# Altium schematic sheet Bowlong Machine.SchDoc
size A3; SheetNumber: 1; SheetTotal: 1
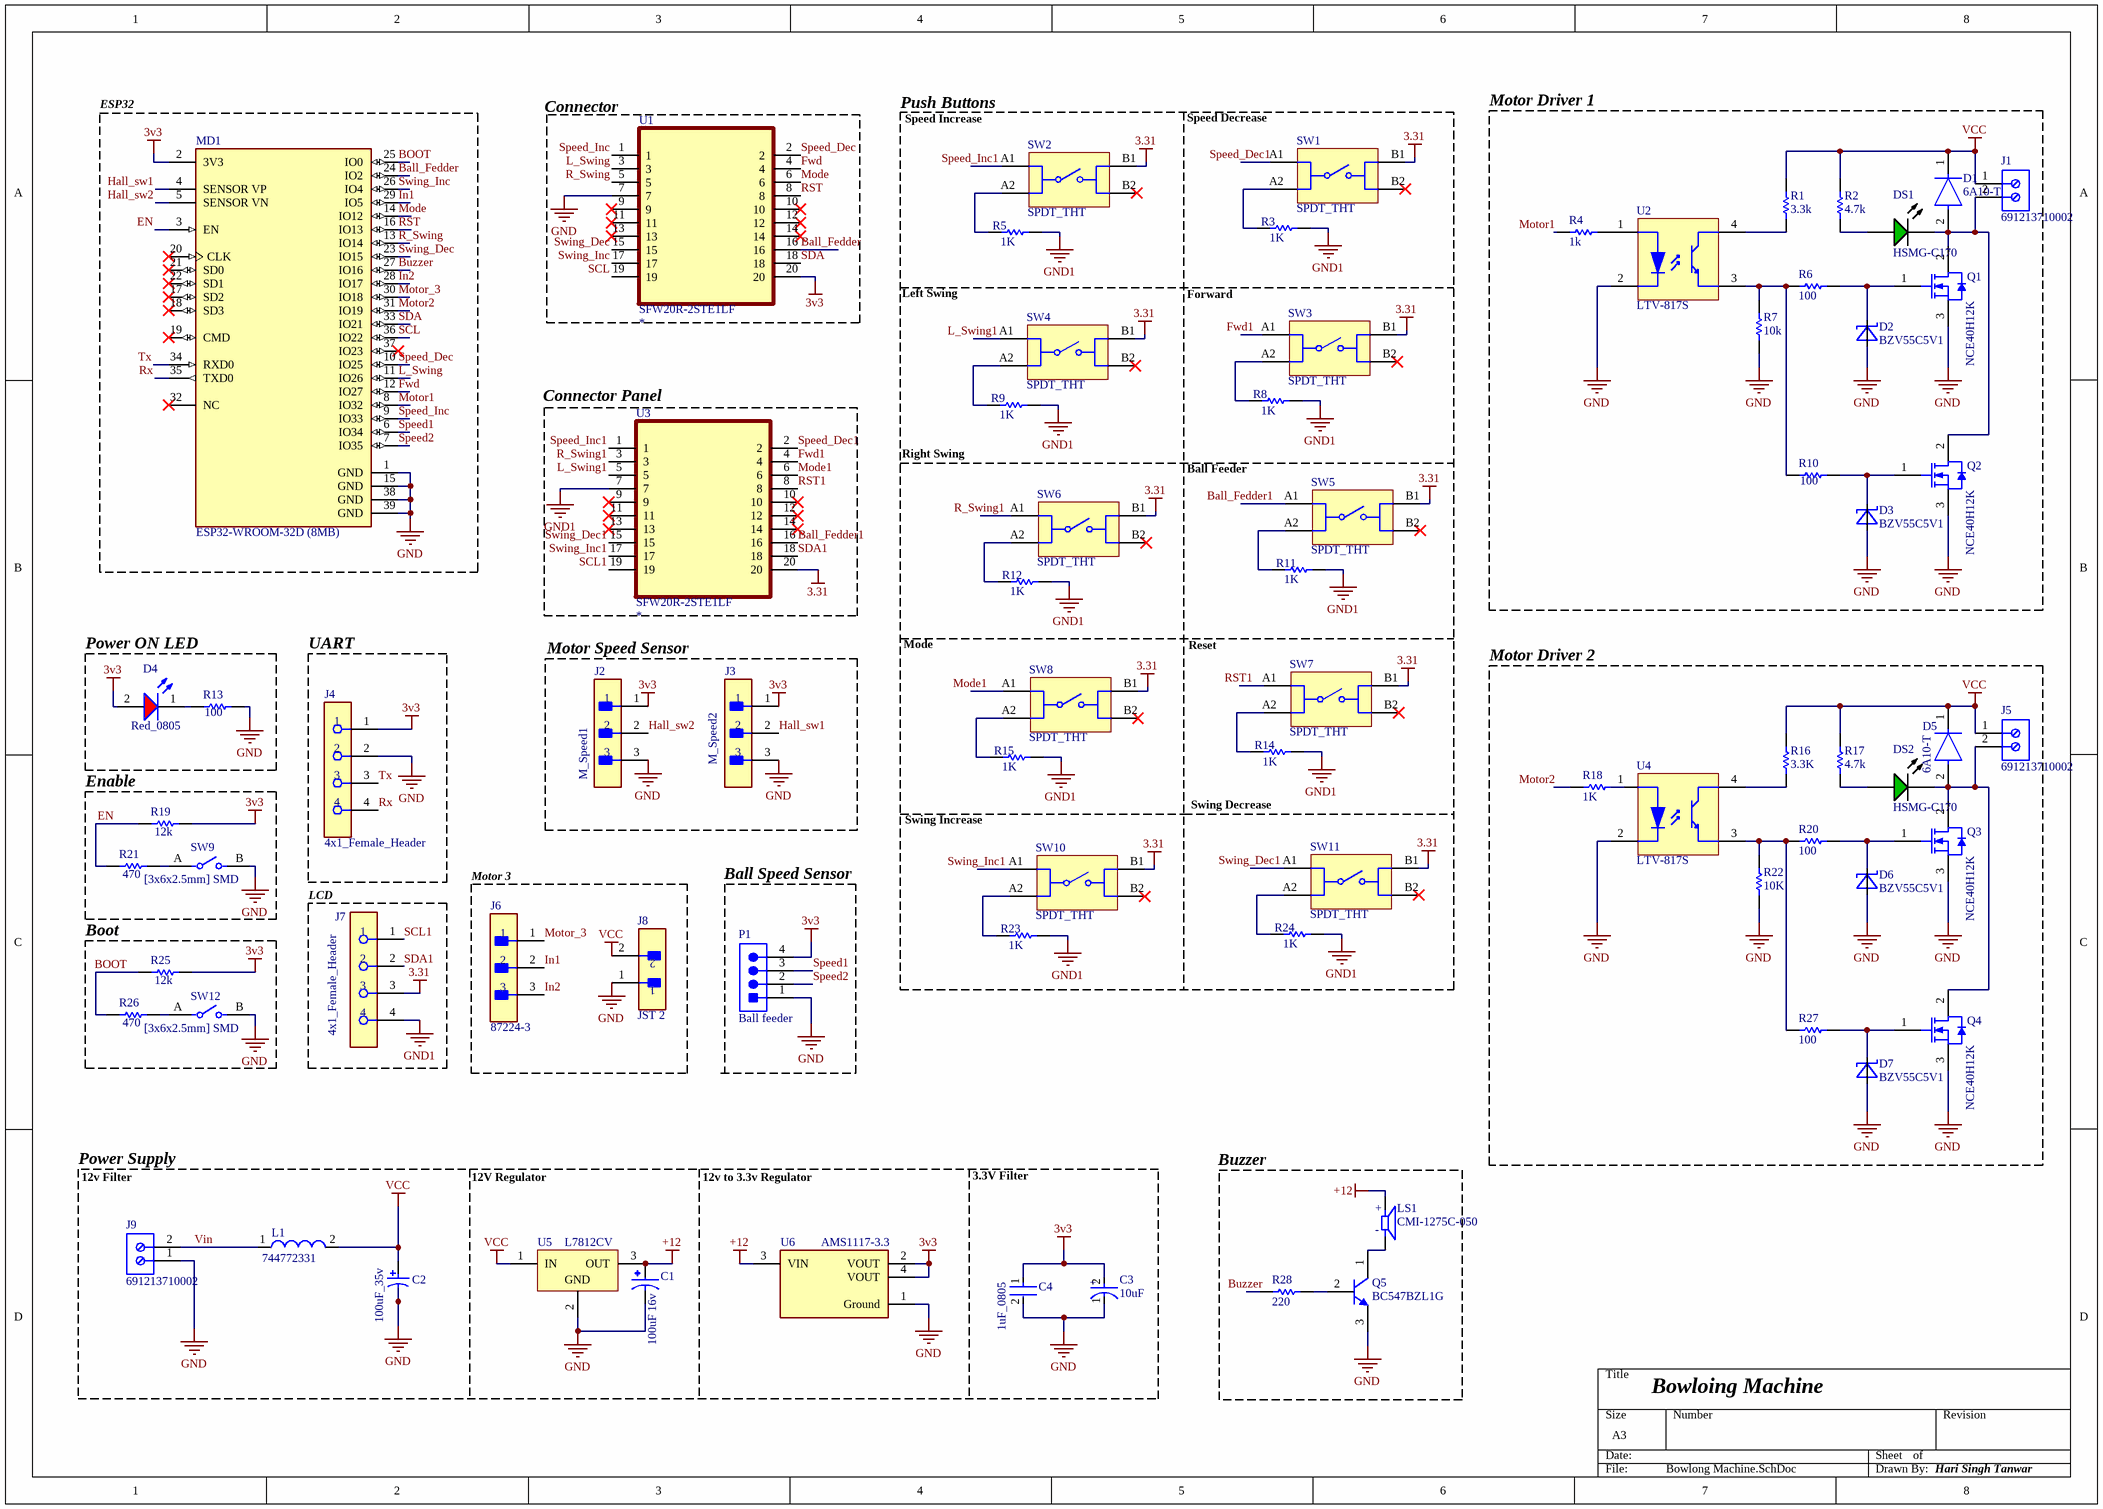
[diagram p0: Bowlong Machine.SchDoc]

## Parts
C1  100uF 16v  [CAPPRD250W50D630H1120]
C2  100uF_35v  [PNSC-EEU-EE2G100-2_V]
C3  10uF  [FP-SC-MFG]
C4  1uF_0805  [FP-CC0805-0_85-MFG]
D1  6A10-T  [FP-R-6-MFG]
D2  BZV55C5V1  [MINIMELF-2]
D3  BZV55C5V1  [MINIMELF-2]
D4  Red_0805  [WL-SMCW_0805_150080xx75000]
D5  6A10-T  [FP-R-6-MFG]
D6  BZV55C5V1  [MINIMELF-2]
D7  BZV55C5V1  [MINIMELF-2]
DS1  HSMG-C170  [AVAG-HSMX-C170_V]
DS2  HSMG-C170  [AVAG-HSMX-C170_V]
J1  691213710002  [691213710002]
J2  M_Speed1  [FP-B3B-XH-A_LF_SN-MFG]
J3  M_Speed2  [FP-B3B-XH-A_LF_SN-MFG]
J4  4x1_Female_Header  [FP-2212S-04SG-85-MFG]
J5  691213710002  [691213710002]
J6  87224-3  [FP-87224-3-MFG]
J7  4x1_Female_Header  [FP-2212S-04SG-85-MFG]
J8  JST 2  [FP-B2B-XH-A_LF_SN-MFG]
J9  691213710002  [691213710002]
L1  744772331  [WE-TI-L]
LS1  CMI-1275C-050  [CUI_CMI-1275C-050]
MD1  ESP32-WROOM-32D (8MB)  [FP-ESP32-WROOM-32D_8MB-MFG]
P1  Ball feeder  [JST-B4B-EH-A_V]
Q1  NCE40H12K  [INF-PG-TO252-3-313_N]
Q2  NCE40H12K  [INF-PG-TO252-3-313_N]
Q3  NCE40H12K  [INF-PG-TO252-3-313_N]
Q4  NCE40H12K  [INF-PG-TO252-3-313_N]
Q5  BC547BZL1G  [ONSC-TO-92-3-29-11_AM_BL]
R1  3.3k  [RESC2013X50X30LL20T20]
R2  4.7k  [RESC2013X50X30LL20T20]
R3  1K  [RESC2013X50X30LL20T20]
R4  1k  [RESC2013X50X30LL20T20]
R5  1K  [RESC2013X50X30LL20T20]
R6  100  [RESC2013X50X30LL20T20]
R7  10k  [RESC2013X50X30LL20T20]
R8  1K  [RESC2013X50X30LL20T20]
R9  1K  [RESC2013X50X30LL20T20]
R10  100  [RESC2013X50X30LL20T20]
R11  1K  [RESC2013X50X30LL20T20]
R12  1K  [RESC2013X50X30LL20T20]
R13  100  [RESC2013X50X30LL20T20]
R14  1K  [RESC2013X50X30LL20T20]
R15  1K  [RESC2013X50X30LL20T20]
R16  3.3K  [RESC2013X50X30LL20T20]
R17  4.7k  [RESC2013X50X30LL20T20]
R18  1K  [RESC2013X50X30LL20T20]
R19  12k  [RESC2013X50X30LL20T20]
R20  100  [RESC2013X50X30LL20T20]
R21  470  [RESC2013X50X30LL20T20]
R22  10K  [RESC2013X50X30LL20T20]
R23  1K  [RESC2013X50X30LL20T20]
R24  1K  [RESC2013X50X30LL20T20]
R25  12k  [RESC2013X50X30LL20T20]
R26  470  [RESC2013X50X30LL20T20]
R27  100  [RESC2013X50X30LL20T20]
R28  220  [RESC2013X50X30LL20T20]
SW1  SPDT_THT  [4301x60707x6]
SW2  SPDT_THT  [4301x60707x6]
SW3  SPDT_THT  [4301x60707x6]
SW4  SPDT_THT  [4301x60707x6]
SW5  SPDT_THT  [4301x60707x6]
SW6  SPDT_THT  [4301x60707x6]
SW7  SPDT_THT  [4301x60707x6]
SW8  SPDT_THT  [4301x60707x6]
SW9  [3x6x2.5mm] SMD  [FP-EVQ-PE105K-MFG]
SW10  SPDT_THT  [4301x60707x6]
SW11  SPDT_THT  [4301x60707x6]
SW12  [3x6x2.5mm] SMD  [FP-EVQ-PE105K-MFG]
U1  SFW20R-2STE1LF  [FCI_SFW20R-2STE1LF]
U2  LTV-817S  [LTST-LTV-817S-4_V]
U3  SFW20R-2STE1LF  [FCI_SFW20R-2STE1LF]
U4  LTV-817S  [LTST-LTV-817S-4_V]
U5  L7812CV  [TO220]
U6  AMS1117-3.3  [FP-AMS1117-IPC_C]

## Blocks framed on the sheet
ESP32: MD1
Connector: U1
Push Buttons: R3 R5 R8 R9 R11 R12 R14 R15 R23 R24 SW1-SW8 SW10 SW11
Motor Driver 1: D1-D3 DS1 J1 Q1 Q2 R1 R2 R4 R6 R7 R10 U2
Connector Panel: U3
Power ON LED: D4 R13
UART: J4
Motor Speed Sensor: J2 J3
Motor Driver 2: D5-D7 DS2 J5 Q3 Q4 R16-R18 R20 R22 R27 U4
Enable: R19 R21 SW9
LCD: J7
Motor 3: J6 J8
Boot: R25 R26 SW12
Power Supply: C1-C4 J9 L1 U5 U6
Buzzer: LS1 Q5 R28

## Nets
3.31: J7.3 SW1.B1 SW2.B1 SW3.B1 SW4.B1 SW5.B1 SW6.B1 SW7.B1 SW8.B1 SW10.B1 SW11.B1 U3.20
3v3: C3.2(A) C4.1 D4.2(A) J2.1 J3.1 J4.1 MD1.2(3V3) P1.4 R19.1 R25.1 U1.20 U6.2(VOUT) U6.4(VOUT)
+12: C1.P LS1.P U5.3(OUT) U6.3(VIN)
GND: C1.N C2.2 C3.1(C) C4.2 D2.A D3.A D6.A D7.A J2.3 J3.3 J4.2 J8.1 J9.1 MD1.1(GND) MD1.15(GND) MD1.38(GND) MD1.39(GND) P1.1 Q1.3(SOURCE) Q2.3(SOURCE) Q3.3(SOURCE) Q4.3(SOURCE) Q5.3(E) R7.1 R13.1 R22.1 SW9.B SW12.B U1.7 U2.2(CATHODE) U4.2(CATHODE) U5.2(GND) U6.1(Ground)
GND1: J7.4 R3.1 R5.1 R8.1 R9.1 R11.1 R12.1 R14.1 R15.1 R23.1 R24.1 U3.7
VCC: C2.1 D1.1(C) D5.1(C) J1.1 J5.1 J8.2 L1.2 R1.2 R2.2 R16.2 R17.2 U5.1(IN)
Ball_Fedder: MD1.24(IO2) U1.16
Ball_Fedder1: SW5.A1 U3.16
BOOT: MD1.25(IO0) R25.2 R26.2
Buzzer: MD1.27(IO16) R28.1
EN: MD1.3(EN) R19.2 R21.2
Fwd: MD1.12(IO27) U1.4
Fwd1: SW3.A1 U3.4
Hall_sw1: J3.2 MD1.4(SENSOR_VP)
Hall_sw2: J2.2 MD1.5(SENSOR_VN)
In1: J6.2 MD1.29(IO5)
In2: J6.3 MD1.28(IO17)
L_Swing: MD1.11(IO26) U1.3
L_Swing1: SW4.A1 U3.5
Mode: MD1.14(IO12) U1.6
Mode1: SW8.A1 U3.6
Motor1: MD1.8(IO32) R4.1
Motor2: MD1.31(IO19) R18.1
Motor_3: J6.1 MD1.30(IO18)
R_Swing: MD1.13(IO14) U1.5
R_Swing1: SW6.A1 U3.3
RST: MD1.16(IO13) U1.8
RST1: SW7.A1 U3.8
Rx: J4.4 MD1.35(TXD0)
SCL: MD1.36(IO22) U1.19
SCL1: J7.1 U3.19
SDA: MD1.33(IO21) U1.18
SDA1: J7.2 U3.18
Speed1: MD1.6(IO34) P1.3
Speed2: MD1.7(IO35) P1.2
Speed_Dec: MD1.10(IO25) U1.2
Speed_Dec1: SW1.A1 U3.2
Speed_Inc: MD1.9(IO33) U1.1
Speed_Inc1: SW2.A1 U3.1
Swing_Dec: MD1.23(IO15) U1.15
Swing_Dec1: SW11.A1 U3.15
Swing_Inc: MD1.26(IO4) U1.17
Swing_Inc1: SW10.A1 U3.17
Tx: J4.3 MD1.34(RXD0)
Vin: J9.2 L1.1
NetD1_2: D1.2(A) DS1.2(K) J1.2 Q1.2(DRAIN) Q2.2(DRAIN)
NetD2_C: D2.C Q1.1(GATE) R6.2
NetD3_C: D3.C Q2.1(GATE) R10.2
NetD4_1: D4.1(K) R13.2
NetD5_2: D5.2(A) DS2.2(K) J5.2 Q3.2(DRAIN) Q4.2(DRAIN)
NetD6_C: D6.C Q3.1(GATE) R20.2
NetD7_C: D7.C Q4.1(GATE) R27.2
NetDS1_1: DS1.1(A) R2.1
NetDS2_1: DS2.1(A) R17.1
NetLS1_N: LS1.N Q5.1(C)
NetQ5_2: Q5.2(B) R28.2
NetR1_1: R1.1 U2.4(COLLECTOR)
NetR3_2: R3.2 SW1.A2
NetR4_2: R4.2 U2.1(ANODE)
NetR5_2: R5.2 SW2.A2
NetR6_1: R6.1 R7.2 R10.1 U2.3(EMITTER)
NetR8_2: R8.2 SW3.A2
NetR9_2: R9.2 SW4.A2
NetR11_2: R11.2 SW5.A2
NetR12_2: R12.2 SW6.A2
NetR14_2: R14.2 SW7.A2
NetR15_2: R15.2 SW8.A2
NetR16_1: R16.1 U4.4(COLLECTOR)
NetR18_2: R18.2 U4.1(ANODE)
NetR20_1: R20.1 R22.2 R27.1 U4.3(EMITTER)
NetR21_1: R21.1 SW9.A
NetR23_2: R23.2 SW10.A2
NetR24_2: R24.2 SW11.A2
NetR26_1: R26.1 SW12.A

Not connected (* = marked no-connect by the designer): MD1 17(SD2)* 18(SD3)* 19(CMD)* 20(CLK)* 21(SD0)* 22(SD1)* 32(NC)* 37(IO23)*; SW1 B2*; SW2 B2*; SW3 B2*; SW4 B2*; SW5 B2*; SW6 B2*; SW7 B2*; SW8 B2*; SW10 B2*; SW11 B2*; U1 9* 10* 11* 12* 13* 14*; U3 9* 10* 11* 12* 13* 14*

## Notes on the sheet
- Speed Increase
- (near SW1) Speed Decrease
- Left Swing
- Forward
- (near R9) Right Swing
- Ball Feeder
- Mode
- Reset
- Swing Increase
- Swing Decrease
- Ball Speed Sensor
- 12v Filter
- 12V Regulator
- 12v to 3.3v Regulator
- 3.3V Filter
- Bowloing Machine
- Hari Singh Tanwar
- (in symbol CMI-1275C-050) +; -
- (in symbol CMP-05427-000087-1) +

## Library data of the parts
C1 = EEUFC1C101H: Cap Aluminum Lytic 100uF 16V 20% (6.3 X 11.2mm) Radial 2.5mm 290mA 1000h 105C Automotive Ammo; MF: Panasonic; MP: EEU-FC1C101H; Package: RADIAL-2 Panasonic; Purchase-URL: https://pricing.snapeda.com/search/part/EEU-FC1C101H/?ref=eda; Value: *; Price: None; SnapEDA_Link: https://www.snapeda.com/parts/EEU-FC1C101H/Panasonic/view-part/2305507/?ref=snap; Check_prices: https://www.snapeda.com/parts/EEU-FC1C101H/Panasonic/view-part/2305507/?ref=eda; Availability: In Stock
C2 = CMP-0736-00002-1: Aluminum Electrolytic Capacitor, 10 uF +/- 20%, 400 V, -25 to 105 degC, 2-Pin 10 x 10 x 22 mm Through-hole, RoHS, Tape and Reel; PartNumber: EEU-EE2G100; Manufacturer: Panasonic; Ripple Current: 430 mA; Rated Voltage: 400 V; Cap.: 10 uF; Capacitance Tolerance: +/- 20%; ComponentLink2URL: http://industrial.panasonic.com/www-data/pdf/ABA0000/ABA0000CE113.pdf; Mounting Technology: Through Hole; PackageVersion: Nov-12; ComponentLink3URL: http://industrial.panasonic.com/www-data/pdf/ABA0000/ABA0000PE245.pdf; ComponentLink2Description: Datasheet; DatasheetVersion: Nov-12; PackageDescription: 2-Pin Through-hole, Base 10 x 10 mm, Height 22 mm; PackageReference: EEU-EE2G100-2; ComponentLink1URL: http://industrial.panasonic.com/; Temp. Range: -25 to 105 degC; RoHS: TRUE; Packing: Tape and Reel; ComponentLink1Description: Manufacturer URL; ComponentLink3Description: Package Specification
C3 = CMP-05427-000087-1: CAP ALUM 10UF 20% 35V SMD; Life (Hours): 2000Hour; Lead Length: 2.2mm; Ripple Current (AC): 30mA; Leakage Current: 3uA; Length: 5.5mm; Construction: Cylindrical; Diameter: 5mm; RoHS Compliant: Yes; REACH SVHC: No SVHC; Capacitance: 10uF; Max Operating Temperature: 85°C; Series: S; Case/Package: Radial; Contact Plating: Tin; Packaging: Tape and Reel; Voltage Rating: 35V; Number of Pins: 2; Height: 5.4mm; Width: 5.3mm; Voltage Rating (DC): 35V; Mount: Surface Mount; Tolerance: 20%; Lead Pitch: 1.5mm; Radiation Hardening: No; Height - Seated (Max): 0.213inch; Ripple Current: 30mA; Voltage: 35V; Package Quantity: 1; Termination: SMD/SMT; Min Operating Temperature: -40°C
C4 = CMP-2100-03606-3: CAP CER 0.1UF 50V X7R 0805; Manufacturer Part Number: CC0805KRX7R9BB104; Manufacturer: Yageo; Tolerance: 0.1; Capacitance: 100 nF; Value: 100 nF; Material: Ceramic; Device Class L1: Passive Components; ComponentLink2Description: Datasheet; Package: CC0805-0.85; Digikey Description: CAP CER 0.1UF 50V X7R 0805; Device Class L3: Ceramic Capacitors; Temperature: -30°C to +85°C; Temperature Characteristic: X7R; Voltage Rating: 50 V; Height: 0.95mm; RoHS: TRUE; Ipc Land Pattern Name: CAPC200125X85; Device Class L2: Capacitors; Category: Cap; Temperature Range Low: -30°C; Temperature Range High: +85°C; Mouser Description: Multilayer Ceramic Capacitors MLCC - SMD/SMT 100nF 50V X7R 10%; Footprint Url: http://www.yageo.com/exep/pages/download/literatures/UPY-C_GEN_24.pdf; Automotive: No; Octopart: https://octopart.com/cc0805krx7r9bb104-yageo-192993; Lead Free: Yes; ComponentLink2URL: http://www.yageo.com/documents/recent/UPY-GPHC_Y5V_6.3V-to-50V_8.pdf
D1 D5 = CMP-12791-000038-1: DIODE GEN PURP 1KV 6A R6; Manufacturer: Diodes Inc.; Max Surge Forward Current: 400A; Reverse Voltage: 1000V; Max Junction Temp: +175°C; Peak Reverse Current: 10uA; Temperature Range High: +175°C; Device Class L1: Discrete Semiconductors; Temperature: -65°C to +175°C; Lead Free: Yes; ComponentLink2URL: https://www.diodes.com/assets/Datasheets/ds28009.pdf; RoHS: TRUE; Height: 9.1mm; Forward Current: 6A; Category: Diode; Ipc Land Pattern Name: DIOAD2054W145L885D885; Max Repetitive Reverse Voltage: 1000V; Mouser Description: Rectifiers 1000V 6A; Footprint Url: https://www.diodes.com/assets/Package-Files/R-6.pdf; ComponentLink2Description: Datasheet; Octopart: https://octopart.com/6a10-t-diodes+inc.-55426548; Device Class L2: Diodes; Temperature Range Low: -65°C; Package: R-6; Automotive: No; Digikey Description: DIODE GEN PURP 1KV 6A R6; Manufacturer Part Number: 6A10-T; Device Class L3: Rectifier Diodes
D2 D3 D6 D7 = BZV55C5V1: Zener Diode 5.1 V 500 mW Â±5% Surface Mount LLDS; MiniMelf; MF: Nexperia USA; MP: BZV55-C5V1; SnapEDA_Link: https://www.snapeda.com/parts/BZV55-C5V1/Nexperia/view-part/?ref=snap; Package: SOD-80 Nexperia USA; Value: *; Check_prices: https://www.snapeda.com/parts/BZV55-C5V1/Nexperia/view-part/?ref=eda
D4 = CMP-1426-00011-2: NexarPartId: 29717781; Peak Wavelength: 630nm; Wavelength: 625nm; Viewing Angle: 140°; Test Current: 20mA; Forward Voltage: 2V; Forward Current: 100mA; Lens Style: Clear, Rectangular; Color: Red; Luminous Intensity: 150mcd; Max Reverse Voltage (DC): 5V; Length: 2mm; Case Code (Imperial): 0805; RoHS: Compliant; Max Operating Temperature: 85°C; Height: 700µm; Packaging: Tape and Reel; Case/Package: 0805; REACH SVHC: Unknown; Dominant Wavelength: 625nm; Min Operating Temperature: -40°C; Case Code (Metric): 2012; Mount: Surface Mount; Width: 1.25mm
DS1 DS2 = CMP-2000-05062-1: Chip LED, Green, 2.2 V, -40 to 85 degC, 2-Pin SMD, Pb-Free, Tape and Reel; Manufacturer: Avago; No. of Pins: 2; Peak Wavelength: 570nm; SVHC: NoSVHC(16-Jun-2014); Dominant Wavelength: 572nm; Forward Current If: 20mA; Viewing Angle: 170deg; Lens Shape: Rectangular; PIV Max: 5V; External Width: 1.25mm; LED Type: Standard; External Depth: 0.8mm; Opto Mounting Orientation: Top; Luminous Intensity: 15mcd; Luminous Intensity Min: 4mcd; Forward Voltage VF Max: 2.6V; External Length / Height: 2mm; Bulb Size: 1.25mmx1.4mm; Light Area Height: 1mm; Voltage Vf Typ: 2.2V; Operating Temperature Max: 85degC; Datasheet Version: Oct-08; MSL: MSL2A-4weeks; Peak Forward Current: 20mA; Package Description: 2-Pin Surface Mount Device, Body 2 x 1.25 mm, Height 0.8 mm; Datasheet URL: https://datasheet.ciiva.com/29280/180495-da-01-en-chip-led-hsmg-c170-gelb-gruen-29280971.pdf; Storage Temperature Min: -40degC; LED Colour: Green; Wavelength Typ: 570nm; Mounting Type: SMD; Forward Current If Max: 20mA; Dominant Wavelength Typ: 572nm; LED Mounting: SMD; Operating Temperature Range: -30degCto+85degC; Operating Temperature Min: -30degC; Manufacturer URL: http://www.avagotech.com/; Packaging: CutTape; Luminous Intensity Typ: 15mcd; Package Reference: HSMX-C170; Storage Temperature Max: 85degC; Opto Case Style: SMD; Forward Voltage: 2.2V
J1 J5 J9 = CMP-1502-02526-2: NexarPartId: 8917718; Number of Contacts: 2; Current Rating: 10A; Stripping Length: -7mm; Wire Gauge (Max): 26AWG; Plating: Brass, Steel; Wire Gauge (Min): 16AWG; Voltage: 300V; Number of Levels: 1; Pitch: 5.0038mm; Color: Green; Number of Pins: 2; Housing Material: Nylon; Termination: Screw; Max Operating Temperature: 105°C; Min Operating Temperature: -40°C; Packaging: Box; Current: 10A; REACH SVHC: Unknown; Width: 10.6mm; RoHS: Compliant; Mount: Through Hole; Height: 10mm; Contact Material: Brass; Length: 8.3mm; Lead Pitch: 5mm; Wire/Cable Gauge: 26AWG; Voltage Rating: 300V; Number of Positions Per Level: 2; Contact Plating: Tin
J2 J3 = CMP-17439-000014-3: CONN HEADER VERT 3POS 2.5MM; Max Voltage Rating (DC): 250V; Number of Positions: 3; Current Rating: 3A; Gender: Male; Wire/Cable Gauge: 22AWG; Contact Resistance: 20mR; Insulation Resistance: 1GR; Insulation Material: Nylon; Contact Plating: Tin; Depth: 5.75mm; Contact Type: Male Pin; Max Operating Temperature: 85°C; Insulation Color: Natural; Voltage Rating (AC): 250V; Color: Natural; Connector Type: Header; Orientation: Straight; Fastening Type: Detent; Housing Color: White; Min Operating Temperature: -25°C; Termination: Solder; Voltage Rating: 250V; Series: XH; Pitch: 2.5mm; Contact Shape: Square; Number of Rows: 1; Lead Free: Lead Free; Packaging: Bulk; Mount: Through Hole; Flammability Rating: UL94 V-0; Max Voltage Rating (AC): 250V; REACH SVHC: No SVHC; Housing Material: Polyamide; Contact Material: Brass; Lead Pitch: 2.5mm; Contact Finish - Mating: TIN; Length: 9.9mm; Max Current Rating: 3A; Number of Contacts: 3
J4 J7 = CMP-12414-000003-1: Header, Rectangular, 4 Positions, 2.54mm Pitch, Receptacle, Vertical, Through-Hole; Number of Contacts: 4; Insulation Resistance: 1GR; REACH SVHC: No SVHC; Mount: Through Hole; Termination: Through Hole; Number of Rows: 1; Flammability Rating: UL94 V-0; RoHS Compliant: Yes; Gender: Receptacle; Contact Plating: Gold; Length: 0.43inch; Width: 0.12inch; Weight: 0.11lb; Height: 0.35inch; Contact Material: Bronze
J6 = CMP-2000-05697-2: CONN HEADER VERT 3POS 2.54MM; Number of Positions: 3; Gasket: No (Without); High Speed Serial Data Connector: No; Current Rating: 3A; Contact Post Length: 0.125inch; PCB Thickness: 1.397mm; PCB Mount Retention: Without; Connector Type: Plug; Approvals: CSA; PCB Mounting Orientation: Vertical; Pitch: 2.54mm; Mating Alignment: No (Without); Housing Color: Black; Contact Gender: Male; Length: 7.21mm; Max Operating Temperature: 105°C; Strain Relief: No (Without); Contact Material: Bronze; Row Spacing: 2.54mm; Series: AMPMODU MOD II; Board Standoff: No (Without); Package Quantity: 520; Radiation Hardening: No; Contact Protection: No (Without); Stabilizers: No (Without); Number of Rows: 1; Contact Mating Length: 8.08mm; Contact Shape: Square; Depth: 2.54mm; Contact Current Rating: 3A; Flammability Rating: UL94 V-0; Packaging: Carton; Number of Contacts: 3; Orientation: Straight; Mount: Through Hole; Keyed: No; Contact Type: Male Pin; Housing Material: Thermoplastic; High Temperature Housing: No; ELV: Compliant; Contact Plating: Gold; Termination: Through Hole; Selectively Loaded: No (Without); Lead Free: Lead Free; Min Operating Temperature: -65°C; Mating Connector Lock: No (Without); Color: Black; RoHS Compliant: Yes
J8 = CMP-2000-05888-3: CONN HEADER VERT 2POS 2.5MM; Current Rating: 3A; Voltage Rating: 250V; Number of Contacts: 2; Contact Resistance: 20mR; Wire/Cable Gauge: 22AWG; Insulation Resistance: 1GR; Connector Type: Male Pin; Packaging: Bulk; Contact Material: Brass; Lead Free: Lead Free; Orientation: Straight; Contact Plating: Tin; Max Current Rating: 3A; Termination: Solder; Fastening Type: Detent; Depth: 5.75mm; Housing Material: Polyamide; REACH SVHC: No SVHC; Series: XH; Voltage Rating (AC): 250V; Number of Positions: 2; Color: Natural; Contact Type: Male Pin; Max Voltage Rating (DC): 250V; Pitch: 2.5mm; Lead Pitch: 2.5mm; Mount: Through Hole; Max Operating Temperature: 85°C; Length: 7.4mm; Max Voltage Rating (AC): 250V; Min Operating Temperature: -25°C; Number of Rows: 1; Housing Color: White
L1 = CMP-1405-00029-1: Radial Leaded Wire Wound Inductor WE-TI, L=330 µH; Manufacturer: Wuerth Elektronik; Inductance: 330 ÂµH; PackageDescription: THT Inductor, 2-Leads, Body 7.8 x 7.8 mm; PartNumber: 744772331; PackageReference: WE-TI-L; ComponentLink1Description: Manufacturer URL; ComponentLink2URL: http://www.we-online.de/katalog/media/pdf/744772331.pdf; ComponentLink1URL: http://www.we-online.com; ComponentLink2Description: Datasheet
LS1 = CMI-1275C-050: 12 mm, 5 Vdc, 90 dB, 3.1 kHz, Through Hole, Magnetic Audio Indicator Buzzer; MF: CUI Devices; SnapEDA_Link: https://www.snapeda.com/parts/CMI-1275C-050/CUI%20Devices/view-part/2772244/?ref=snap; Price: None; Mouser-Purchase-URL: https://snapeda.com/shop?store=Mouser&id=2772244; CUI_purchase_URL: https://www.cuidevices.com/product/audio/buzzers/audio-indicators/cmi-1275c-050?utm_source=snapeda.com&utm_medium=referral&utm_campaign=snapedaBOM; DigiKey-Purchase-URL: https://snapeda.com/shop?store=DigiKey&id=2772244; Value: *; MP: CMI-1275C-050; Package: TO-220 CUI Inc.; Availability: Unavailable
MD1 = CMP-194065-000011-1: RX TXRX MOD WIFI TRACE ANT SMD; Interface: I2C; Memory Size: 536KB; Sensitivity: -98dBm; Frequency: 2.5GHz; Data Rate: 150Mbps; Max Operating Temperature: 85°C; Mount: Surface Mount; Case/Package: SMD/SMT; Packaging: Tape and Reel; Min Operating Temperature: -40°C
P1 = CMP-2000-05904-1: Male Header, Pitch 2.5 mm, 1 x 4 Position, Height 6 mm, Tail Length 3.2 mm, -25 to 85 degC, RoHS, Bulk; Manufacturer: JST; Style/Orientation: StraightHeader/Plug; Pitch: 2.5mm; No of Positions: 4; Mounting Technology: SurfaceMount; Package Description: Male Header, Pitch 2.5 mm, 1 x 4 Position, Height 6 mm, Tail Length 3.2 mm; Datasheet Version: 12/2012; Type: ShroudedHeader; Package Reference: B4B-EH-A; Manufacturer URL: http://www.jst.com/home2.html; Termination: Crimp; Datasheet URL: http://www.jst-mfg.com/product/pdf/eng/eEH.pdf
Q1-Q4 = CMP-1164-00353-1: N-Channel CoolMOS C6 Power-Transistor, 600 V VDS, 8.1 A ID, -55 to 150 degC, PG-TO252-3-313, Reel, Green; Manufacturer: Infineon; PartNumber: IPD60R520C6; QG: 23.4Â nC; VGS(th) (max): 3.5Â V; Green: TRUE; Ptot (max): 66Â W; Polarity: N; RthJC (max): 1.9Â K/W; ID (max): 8.1Â A; VDS (max): 600Â V; RDS (on) (max): 520Â mOhm; RthJA (max): 62Â K/W; IDpuls (max): 22Â A; VGS(th) (min): 2.5Â V; PackageVersion: Oct-10; Packing: Reel; PackageReference: PG-TO252-3-313; Mounting Technology: Surface Mount; ComponentLink1URL: http://www.infineon.com/; ComponentLink3Description: Package Specification; ComponentLink2Description: Datasheet; Rth: 1.9Â K/W; ComponentLink3URL: http://www.infineon.com/dgdl/PG-TO252-3-313-Package_Overview.pdf?folderId=db3a30432b57a660012b81890ade72d2&fileId=db3a30432b57a660012b8193af2872eb; PackageDescription: 3-Pin Plastic (Green) Transistor Single Outline Package, 6.5 x 6.12 mm Body, 2.28 mm Pitch; Technology: CoolMOS C6; ComponentLink1Description: Manufacturer URL; DatasheetVersion: Rev. 2.0; ComponentLink2URL: http://www.infineon.com/dgdl/IPD60R520C6_2.0.pdf?folderId=db3a3043163797a6011638933eda014b&fileId=db3a304323b87bc20123e676d18358fb
Q5 = CMP-1048-01604-1: Amplifier Transistor, NPN Silicon, 3-Pin TO-92, Pb-Free, Ammo Box; Manufacturer: On Semiconductor; fT Min (MHz): 150; IC Continuous (A): 0.1; ComponentLink2Description: Datasheet; Mounting Technology: Through Hole; PackageReference: TO-92-3-29-11_AM_BL; ComponentLink3URL: http://www.onsemi.com/pub_link/Collateral/MAC97-D.PDF; ComponentLink1URL: http://www.onsemi.com/; PackageVersion: Rev. AM; ComponentLink1Description: Manufacturer URL; DatasheetVersion: Rev. 7; ComponentLink3Description: Package Specification; Packing: Ammo Box; RoHS: TRUE; ComponentLink2URL: http://www.onsemi.com/pub_link/Collateral/BC546-D.PDF; Polarity: NPN; PartNumber: BC547BZL1G; PackageDescription: 3-Pin Transistor Outline, Body 4.825 x 3.685 mm, Pitch 1.27 mm
R1-R28 = CMP-2001-04896-1: Manufacturer: Vishay Dale; Part Number: CRCW08050000Z0EA
SW1-SW8 SW10 SW11 = CMP-1453-00013-2: NexarPartId: 38794740; Switch Travel: 250µm; Switch Function: Off-Mom; Illumination Type: Illuminated, Non-Illuminated; Current Rating: 50mA; Insulation Resistance: 100MΩ; Throw Configuration: SPST; Mechanical Life: 1Mcycles; Actuator Material: Liquid Crystal Polymer, Polymer; Voltage Rating: 12V; Packaging: Bulk; Length: 6.2mm; Mount: Through Hole; Height: 7mm; REACH SVHC: No SVHC; Contact Current Rating: 50mA; Termination: PC Pin; Diameter: 3mm; Color: Black; Contact Material: Steel; Width: 6.2mm; Contact Plating: Silver; Max Operating Temperature: 85°C; RoHS: Compliant; Min Operating Temperature: -40°C
SW9 SW12 = CMP-00287-39857596-1: EVQ-PE105K Switch Tactile N.O. SPST Rectangular Button J-Bend 0.05A 12VDC 1N SMD Embossed Tape; Voltage Rating (DC): 12V; Contact Resistance: 100mΩ; Switch Function: Off-Mom; Illumination Type: Illuminated, Non-Illuminated; Mechanical Life: 50kcycles; Contact Current Rating: 50mA; Switch Travel: 250µm; Number of Positions: 2; Actuator Length: 1.5mm; Length: 6mm; REACH SVHC: No SVHC; Max Operating Temperature: 85°C; NexarPartId: 39857596; Height: 5mm; Min Operating Temperature: -30°C; Contact Plating: Gold, Silver; Depth: 7.2mm; RoHS: Compliant; Max Voltage Rating (DC): 12V; Color: Black; Termination: Gull Wing; Orientation: Straight; Lead Free: Lead Free; Max Current Rating: 50mA; Electrical Life: 50kcycles; Mount: Surface Mount; Current Rating: 50mA; Radiation Hardening: No; Throw Configuration: SPST; Width: 3.5mm; Operating Force: 1N
U1 U3 = CMP-008-000000-1: FFC/FPC CONNECTOR, RECEPTACLE 20POS 1ROW; Package: None; Price: None; Component Type: Standard; Design Item ID: SFW20R-2STE1LF; Availability: Unavailable; Value: *; Source: SFW20R-2STE1LF.SchLib; MP: SFW20R-2STE1LF; Pin Count: 20
U2 U4 = CMP-2000-05204-1: Photocoupler - Phototransistor Output, 35 V VCEO, -50 to 110 degC, 4-Pin SMD, RoHS, Tape and Reel; Manufacturer: Lite-On; Collector Current (DC): 0.05A; Collector-Emitter Voltage: 35V; Fall Time: 18000ns; Reverse Breakdown Voltage: 6V; Forward Voltage: 1.4V; Output Type: DC; Forward Current: 50mA; Isolation Voltage: 5000V; Number of Elements: 1; Rad Hardened: No; Power Dissipation: 0.2W; Current Transfer Ratio: 600%; DELETED: Compliant; Collector-Emitter Saturation Voltage: 0.2V; Datasheet URL: https://datasheet.ciiva.com/15118/getdatasheetpartid-147501-15118828.pdf; Package Type: PDIPSMD; Collector Current (DC) (Max): 0.05A; Manufacturer URL: http://www.us.liteon.com/; Rise Time: 18000ns; Operating Temperature Classification: Commercial; Output Device: Transistor; Input Type: DC; Datasheet Version: Jan-10; Operating Temp Range: -30Cto100C; Mounting: SurfaceMount; Pin Count: 4
U5 = CMP-0244-00450-1: Positive Voltage Regulator, 12V, 3-Pin TO-220; PackageDescription: TO, Thru-Hole, Vertical, Heatsink Mounted; 3 In-Line Leads; Pitch 2.54 mm; ComponentLink3URL: http://www.st.com/internet/com/TECHNICAL_RESOURCES/TECHNICAL_LITERATURE/PACKAGE_INFORMATION/CD00004649.pdf; ComponentLink1URL: http://www.st.com; ComponentLink2Description: Datasheet; ComponentLink3Description: Package Specification; ComponentLink2URL: http://www.st.com/internet/com/TECHNICAL_RESOURCES/TECHNICAL_LITERATURE/DATASHEET/CD00000444.pdf; DatasheetVersion: 16/11/2011; PackageVersion: ver3.0; PackageReference: TO220; ComponentLink1Description: Manufacturer URL
U6 = CMP-209535-000001-1: LDO Voltage Regulators 1A, 3.3V; Manufacturer: Advanced Monolithic Systems; Dropout Voltage: 1.1V; Output Type: Fixed; Nominal Supply Current: 5mA; Max Power Dissipation: 1.2W; Max Supply Voltage: 15V; Number Of Outputs: 1; Standoff Height: 0.64mm; Max Junction Temp: +125°C; Height: 1.8mm; Package: AMS1117; Device Class L2: Power Management ICs; ComponentLink2Description: Datasheet; ComponentLink2URL: http://www.advanced-monolithic.com/pdf/ds1117.pdf; Category: IC; RoHS: TRUE; Automotive: No; Device Class L1: Integrated Circuits (ICs); Output Current: 1A; Device Class L3: Voltage Regulators - Linear; Temperature: -40°C to +125°C; Output Voltage: 3.3V; Manufacturer Part Number: AMS1117-3.3; Temperature Range Low: -40°C; Octopart: https://octopart.com/ams1117-3.3-advanced+monolithic+systems-25899300; Lead Free: Yes; Ipc Land Pattern Name: SOT229P700X180-4; Temperature Range High: +125°C